# EAGLE schematic schematic (EAGLE 9.3.0)
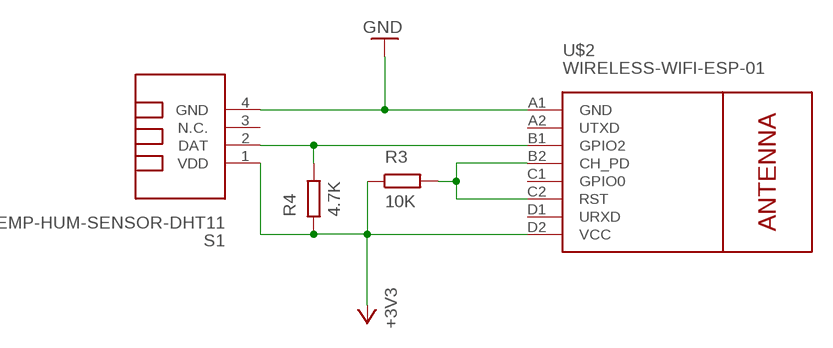
[diagram p0: schematic, sheet 1]

## Parts
R3  10K  R  (no package)
R4  4.7K  R  (no package)
S1  TEMP-HUM-SENSOR-DHT11  [TEMP-HUM-SENSOR-DHT11]
U$2  WIRELESS-WIFI-ESP-01  [WIRELESS-WIFI-ESP-01]

## Nets
+3V3: R3.1 R4.1 S1.1(VDD) U$2.D2(VCC)
GND: S1.4(GND) U$2.A1(GND)
N$1: R4.2 S1.2(DAT) U$2.B1(GPIO2)
N$2: R3.2 U$2.B2(CH_PD) U$2.C2(RST)
Unconnected: S1.3(N.C.) U$2.A2(UTXD) U$2.C1(GPIO0) U$2.D1(URXD)

## Library data of the parts
R3 = ngspice-simulation:R: RESISTOR; _EXTERNAL_: 10K
R4 = ngspice-simulation:R: RESISTOR
S1 = diy-modules:TEMP-HUM-SENSOR-DHT11: DHT11 - digital humidity & temperature sensor DHT11 datasheet available here: https://akizukidenshi.com/download/ds/aosong/DHT11.pdf Click here to find device on ebay.com <http://www.ebay.com/sch/dht11+digital+sensor>
U$2 = diy-modules:WIRELESS-WIFI-ESP-01: Wireless Wi-Fi ESP-01 Module based on ESP8266 chip Click here to find device on ebay.com <http://www.ebay.com/sch/esp8266+esp+01+transceiver>